# Altium schematic sheet POWER.SchDoc
size A4
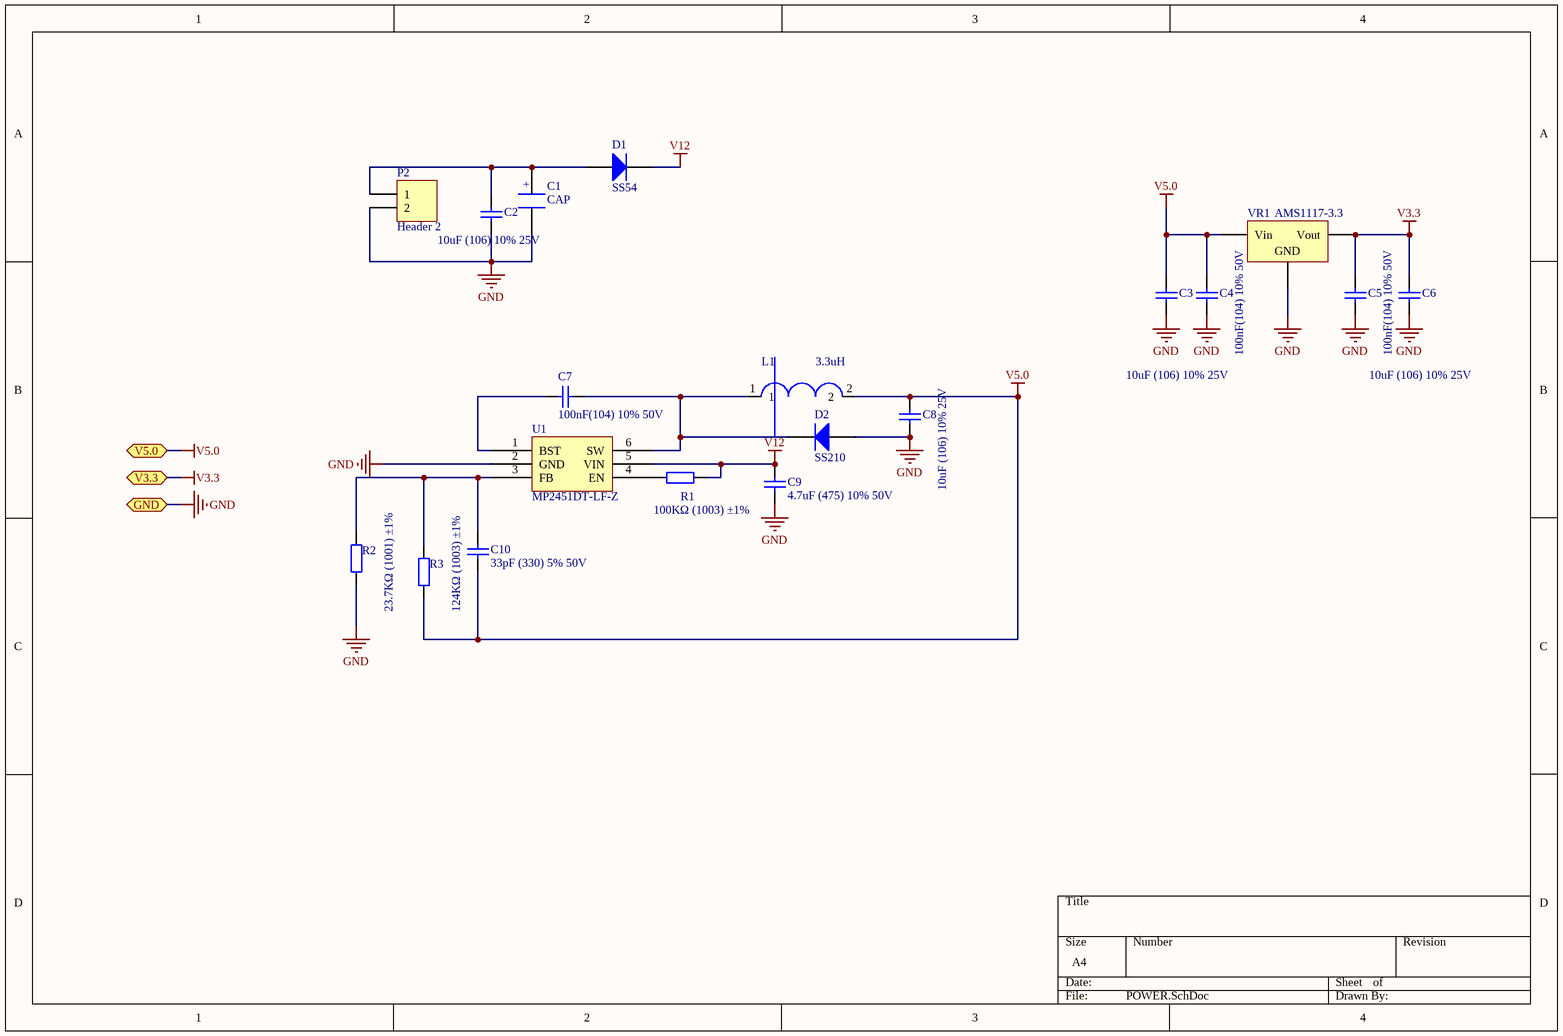
[diagram p0: POWER.SchDoc]

## Parts
C1  CAP  [8X12_CAP]
C2  10uF (106) 10% 25V  [0805_C]
C3  10uF (106) 10% 25V  [0805_C]
C4  100nF(104) 10% 50V  [0805_C]
C5  100nF(104) 10% 50V  [0805_C]
C6  10uF (106) 10% 25V  [0805_C]
C7  100nF(104) 10% 50V  [0805_C]
C8  10uF (106) 10% 25V  [0805_C]
C9  4.7uF (475) 10% 50V  [1206_C]
C10  33pF (330) 5% 50V  [0805_C]
D1  SS54  [SMA(DO-214AC)_S1]
D2  SS210  [SMA(DO-214AC)_S1]
L1  3.3uH  [L_4030]
P2  Header 2  [WJ25]
R1  100KΩ (1003) ±1%  [0805_R]
R2  23.7KΩ (1001) ±1%  [0805_R]
R3  124KΩ (1003) ±1%  [0805_R]
U1  MP2451DT-LF-Z  [SOT-23-6]
VR1  AMS1117-3.3  [SOT-223]

## Ports
GND, V3.3, V5.0

## Nets
GND: C1.2 C2.1 C3.1 C4.1 C5.1 C6.1 C8.1 C9.1 D2.1(A) P2.2 R2.1 U1.2(GND) VR1.1(GND) ; port GND
V3.3: C5.2 C6.2 VR1.2(Vout) ; port V3.3
V5.0: C3.2 C4.2 C8.2 C10.1 L1.2 R3.1 VR1.3(Vin) ; port V5.0
V12: C9.2 D1.2(K) R1.1 U1.5(VIN)
NetC1_1: C1.1 C2.2 D1.1(A) P2.1
NetC7_1: C7.1 D2.2(K) L1.1 U1.6(SW)
NetC7_2: C7.2 U1.1(BST)
NetC10_2: C10.2 R2.2 R3.2 U1.3(FB)
NetR1_2: R1.2 U1.4(EN)

## Notes on the sheet
- (in symbol CAP) +

## Library data of the parts
C2 C3 C6 C8 = 0805 10uF (106) 10% 25V: 贴片电容; ComponentLink1Description: 供应商链接; ComponentLink1URL: http://www.szlcsc.com/product/details_16532.html; Package: 0805; Supplier: LC; SuppliersPartNumber: C15850
C4 C5 C7 = 0805 100nF(104) 10% 50V: 贴片电容; ComponentLink1Description: 供应商链接; ComponentLink1URL: http://www.szlcsc.com/product/details_50686.html; Package: 0805; Supplier: LC; SuppliersPartNumber: C49678
C9 = 1206 4.7uF (475) 10% 50V: 贴片电容; ComponentLink1Description: 供应商链接; ComponentLink1URL: http://www.szlcsc.com/product/details_30577.html; Package: 1206; Supplier: LC; SuppliersPartNumber: C29823
C10 = 0805 33pF (330) 5% 50V: 贴片电容; ComponentLink1Description: 供应商链接; ComponentLink1URL: http://www.szlcsc.com/product/details_2166.html; Package: 0805; Supplier: LC; SuppliersPartNumber: C1814
D1 = SMA(DO-214AC) SS54: 二极管; ComponentLink1Description: 供应商链接; ComponentLink1URL: http://www.szlcsc.com/product/details_23178.html; Package: SMA(DO-214AC); Supplier: LC; SuppliersPartNumber: C22452
D2 = SMA(DO-214AC) SS210: 二极管; ComponentLink1Description: 供应商链接; ComponentLink1URL: http://www.szlcsc.com/product/details_15669.html; Package: SMA(DO-214AC); Supplier: LC; SuppliersPartNumber: C14996
L1 = 33uH
P2 = Header 2: Header, 2-Pin; LatestRevisionDate: 17-Jul-2002; LatestRevisionNote: Re-released for DXP Platform.; Publisher: Altium Limited
R1 R3 = 0805 100KΩ (1003) 1%: 贴片电阻; ComponentLink1Description: 供应商链接; ComponentLink1URL: http://www.szlcsc.com/product/details_18095.html; Package: 0805; Supplier: LC; SuppliersPartNumber: C17407
R2 = 0805 1KΩ (1001) 1%: 贴片电阻; ComponentLink1Description: 供应商链接; ComponentLink1URL: http://www.szlcsc.com/product/details_18201.html; Package: 0805; Supplier: LC; SuppliersPartNumber: C17513
U1 = MP2451DT-LF-Z_[C14123]: DC-DC芯片; ComponentLink1Description: 供应商链接; ComponentLink1URL: http://www.szlcsc.com/product/details_14780.html; Package: SOT-23-6; Supplier: LC; SuppliersPartNumber: C14123
VR1 = SOT-223 AMS1117-3.3: 低压差线性稳压(LDO); ComponentLink1Description: 供应商链接; ComponentLink1URL: http://www.szlcsc.com/product/details_6652.html; Package: SOT-223; Supplier: LC; SuppliersPartNumber: C6186